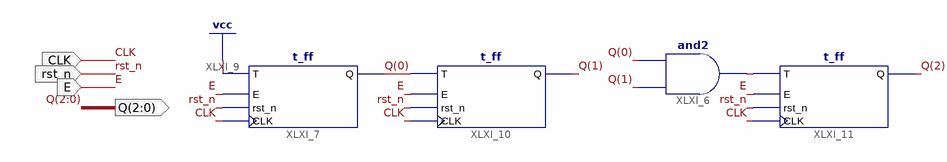
[diagram p0: schematic sheet 1]
// Xilinx ISE schematic Timer.sch (virtex6) as structural Verilog: 4 symbols, 4 ports
module Timer (
  input  rst_n,
  input  CLK,
  input  E,
  output [2:0] Q
);

  wire XLXN_43;

  and XLXI_6 (XLXN_43, Q[1], Q[0]);
  t_ff XLXI_7 (.T(1'b1), .Q(Q[0]), .rst_n(rst_n), .E(E), .CLK(CLK));
  t_ff XLXI_10 (.T(Q[0]), .Q(Q[1]), .rst_n(rst_n), .E(E), .CLK(CLK));
  t_ff XLXI_11 (.T(XLXN_43), .Q(Q[2]), .rst_n(rst_n), .E(E), .CLK(CLK));
endmodule
